# Altium schematic sheet ESP32.SchDoc
size A2; SheetNumber: 1; SheetTotal: 1
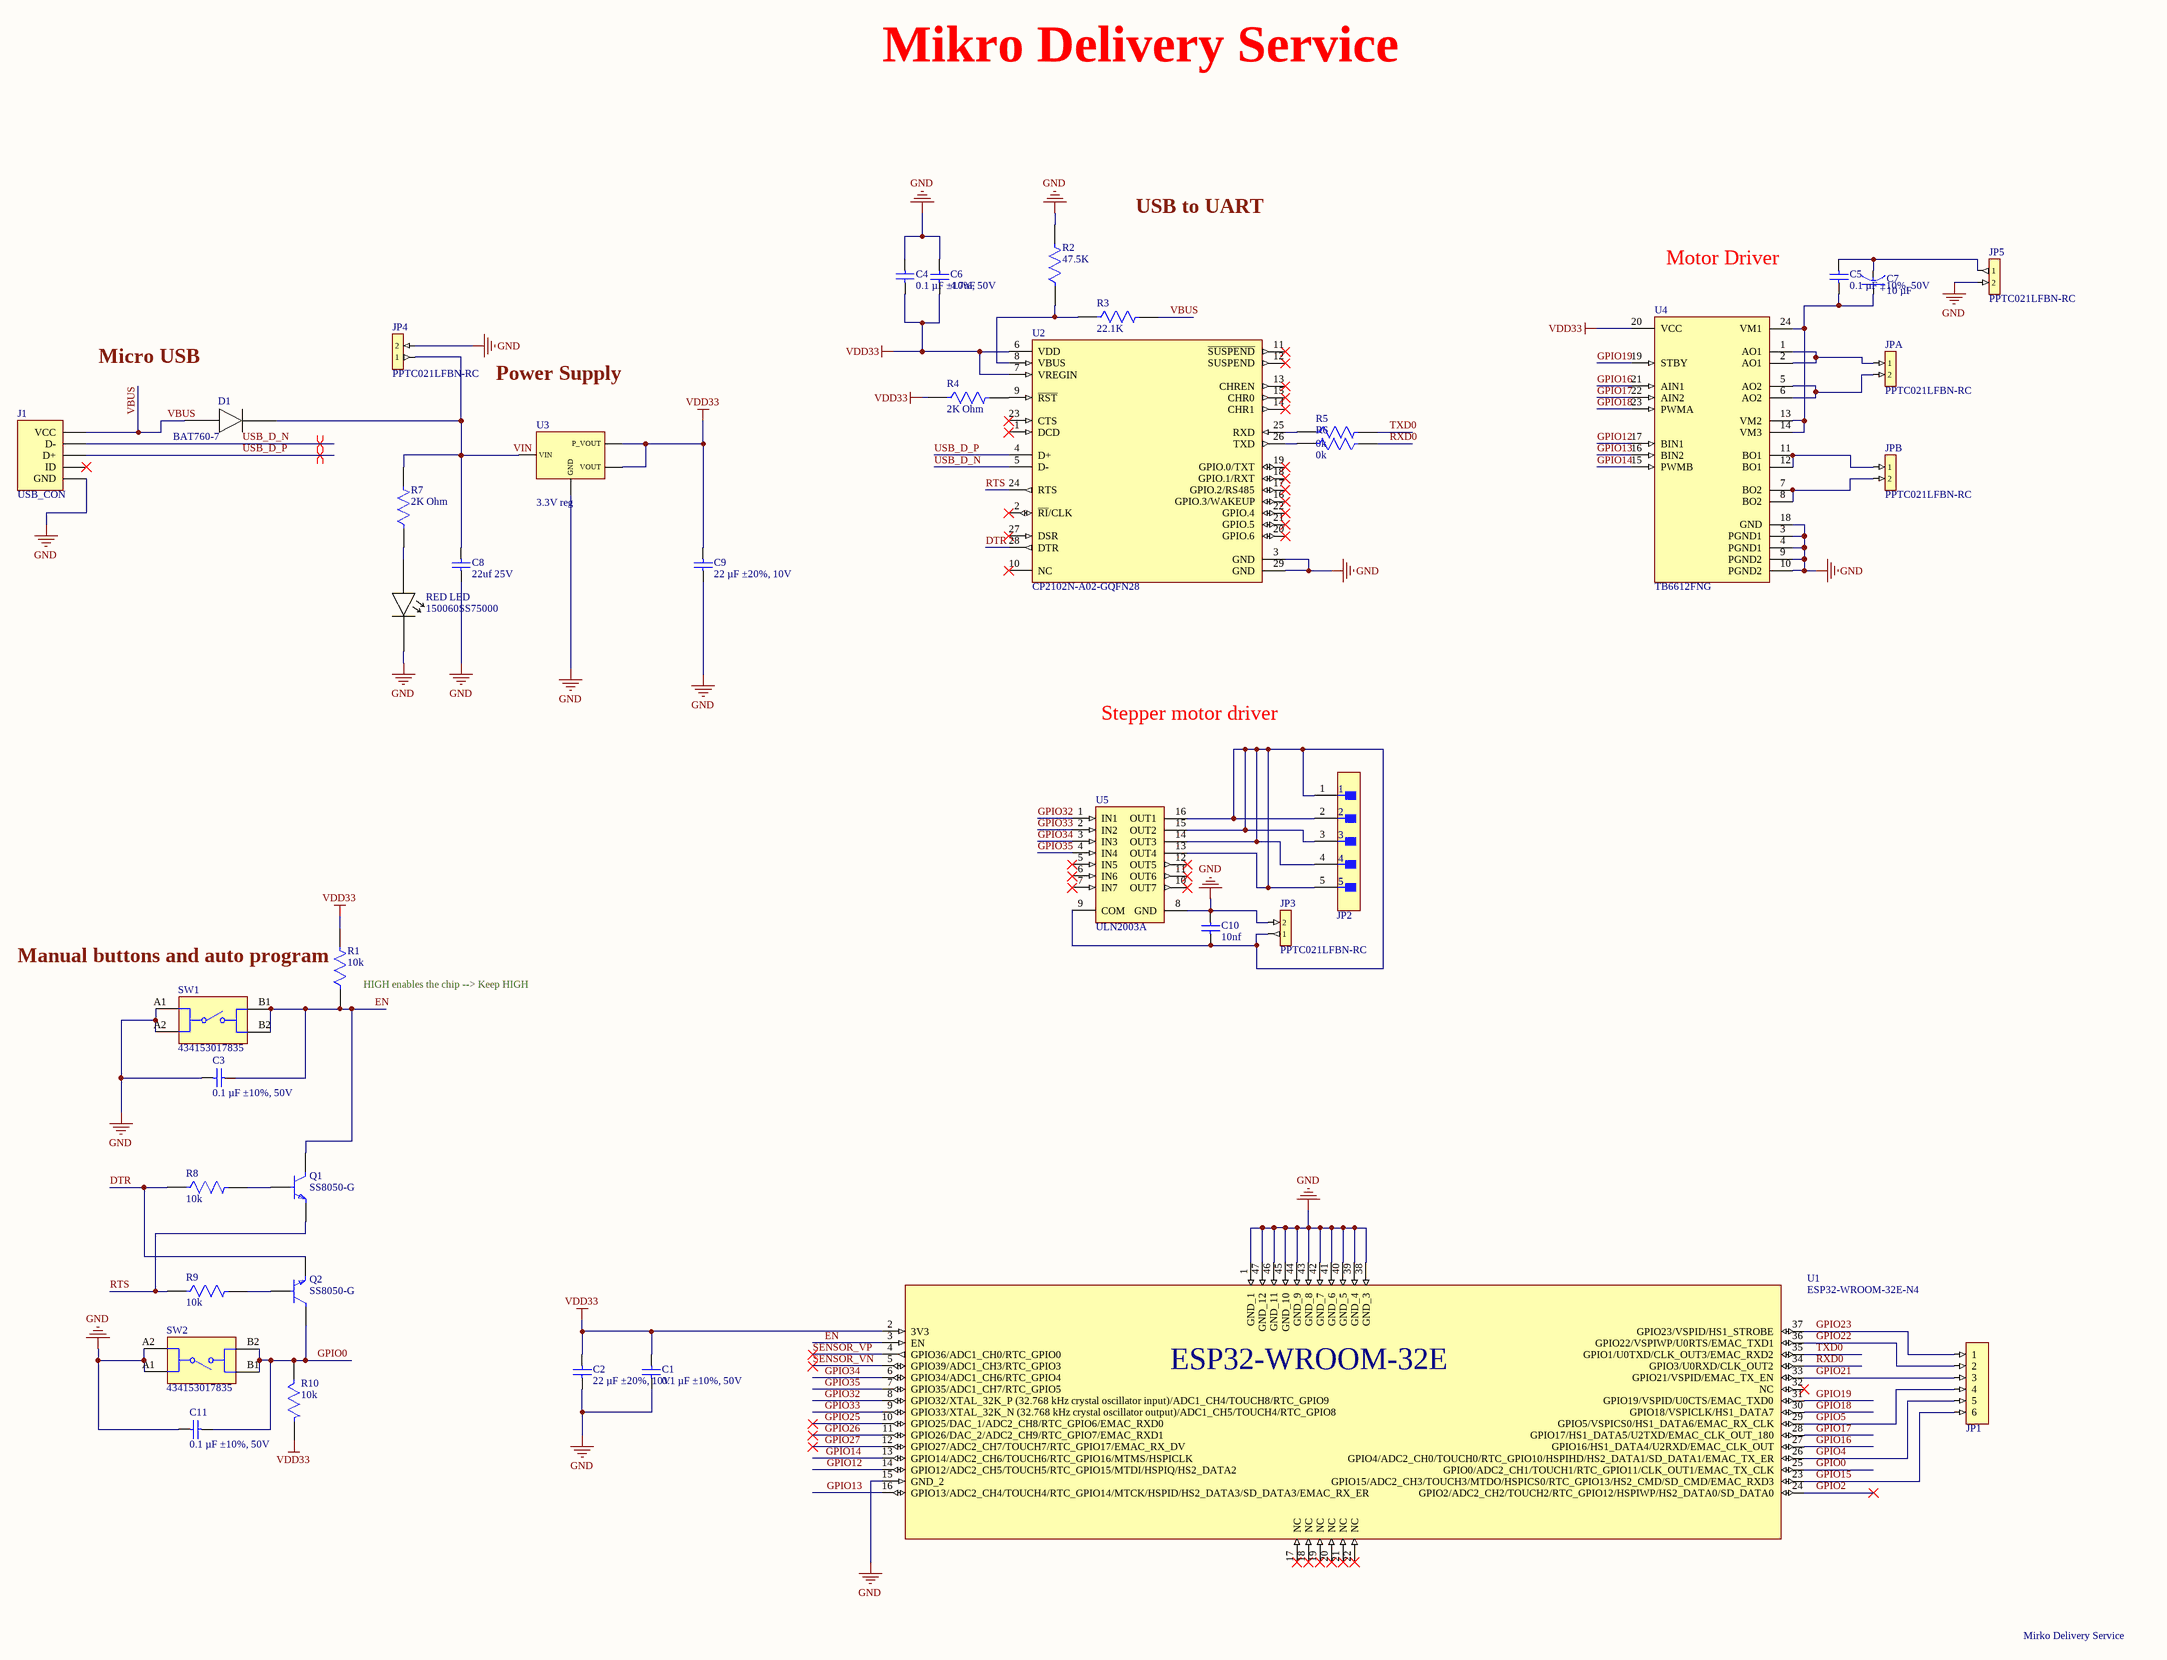
[diagram p0: ESP32.SchDoc]

## Parts
C1  0.1 µF ±10%, 50V  [885012206095]
C2  22 µF ±20%, 10V  [885012108011]
C3  0.1 µF ±10%, 50V  [885012206095]
C4  0.1 µF ±10%, 50V  [885012206095]
C5  0.1 µF ±10%, 50V  [885012206095]
C6  4.7uF  [FP-C0805C475J4RACAUTO-IPC_B]
C7  10 µF  [FP-UWT1C100MCL1GB-MFG]
C8  22uf 25V  [CL31A226KAHNNNE]
C9  22 µF ±20%, 10V  [885012108011]
C10  10nf  [C0402C103K3REC7411]
C11  0.1 µF ±10%, 50V  [885012206095]
D1  BAT760-7  [BAT760-7]
J1  USB_CON  [10118192-0002LF]
JP1  PPPC061LFBN-RC  [PPPC061LFBN-RC]  (value not drawn)
JP2  B5B-XH-A  [FP-B5B-PH-K-S_LF_SN-MFG]  (value not drawn)
JP3  PPTC021LFBN-RC  [PPTC021LFBN-RC]
JP4  PPTC021LFBN-RC  [PPTC021LFBN-RC]
JP5  PPTC021LFBN-RC  [PPTC021LFBN-RC]
JPA  PPTC021LFBN-RC  [PPTC021LFBN-RC]
JPB  PPTC021LFBN-RC  [PPTC021LFBN-RC]
Q1  SS8050-G  [FP-SS8050-G-IPC_B]
Q2  SS8050-G  [FP-SS8050-G-IPC_B]
R1  10k  [FP-RC0402-0_4-IPC_A]
R2  47.5K  [ERJ3EKF4752V]
R3  22.1K  [RC0603FR-0722K1L]
R4  2K Ohm  [560112110015]
R5  0k  [CR0402AJ/-000GAS]
R6  0k  [CR0402AJ/-000GAS]
R7  2K Ohm  [560112110015]
R8  10k  [FP-RC0402-0_4-IPC_A]
R9  10k  [FP-RC0402-0_4-IPC_A]
R10  10k  [FP-RC0402-0_4-IPC_A]
RED_LED  150060SS75000  [150060SS75000]
SW1  434153017835  [434153017835]
SW2  434153017835  [434153017835]
U1  ESP32-WROOM-32E-N4  [FP-ESP32-WROOM-32E_4MB-MFG]
U2  CP2102N-A02-GQFN28  [FP-CP2102N-A02-GQFN28-IPC_C]
U3  3.3V reg  [AMS1117-3.3]
U4  TB6612FNG  [FP-SSOP24-P-300-0_65A-IPC_B]
U5  ULN2003A  [STM-DIP-16L]

## Nets
GND: C1.1 C2.1 C3.1 C4.1 C6.2 C8.1 C9.1 C10.2 C11.1 J1.5(GND) JP3.2 JP4.2 JP5.2 R2.2 RED_LED.1 SW1.A1 SW1.A2 SW2.A1 SW2.A2 U1.1(GND_1) U1.15(GND_2) U1.38(GND_3) U1.39(GND_4) U1.40(GND_5) U1.41(GND_6) U1.42(GND_7) U1.43(GND_8) U1.44(GND_9) U1.45(GND_10) U1.46(GND_11) U1.47(GND_12) U2.3(GND) U2.29(GND) U3.3(GND) U4.3(PGND1) U4.4(PGND1) U4.9(PGND2) U4.10(PGND2) U4.18(GND) U5.8(GND)
VDD33: C1.2 C2.2 C4.2 C6.1 C9.2 R1.2 R4.1 R10.2 U1.2(3V3) U2.6(VDD) U2.7(VREGIN) U3.4(VOUT) U3.5(P_VOUT) U4.20(VCC)
DTR: Q2.2(E) R8.1 U2.28(DTR)
EN: C3.2 Q1.3(C) R1.1 SW1.B1 SW1.B2 U1.3(EN)
GPIO0: C11.2 Q2.3(C) R10.1 SW2.B1 SW2.B2 U1.25(GPIO0/ADC2_CH1/TOUCH1/RTC_GPIO11/CLK_OUT1/EMAC_TX_CLK)
GPIO2: U1.24(GPIO2/ADC2_CH2/TOUCH2/RTC_GPIO12/HSPIWP/HS2_DATA0/SD_DATA0)
GPIO4: JP1.5 U1.26(GPIO4/ADC2_CH0/TOUCH0/RTC_GPIO10/HSPIHD/HS2_DATA1/SD_DATA1/EMAC_TX_ER)
GPIO5: JP1.4 U1.29(GPIO5/VSPICS0/HS1_DATA6/EMAC_RX_CLK)
GPIO12: U1.14(GPIO12/ADC2_CH5/TOUCH5/RTC_GPIO15/MTDI/HSPIQ/HS2_DATA2) U4.17(BIN1)
GPIO13: U1.16(GPIO13/ADC2_CH4/TOUCH4/RTC_GPIO14/MTCK/HSPID/HS2_DATA3/SD_DATA3/EMAC_RX_ER) U4.16(BIN2)
GPIO14: U1.13(GPIO14/ADC2_CH6/TOUCH6/RTC_GPIO16/MTMS/HSPICLK) U4.15(PWMB)
GPIO15: JP1.6 U1.23(GPIO15/ADC2_CH3/TOUCH3/MTDO/HSPICS0/RTC_GPIO13/HS2_CMD/SD_CMD/EMAC_RXD3)
GPIO16: U1.27(GPIO16/HS1_DATA4/U2RXD/EMAC_CLK_OUT) U4.21(AIN1)
GPIO17: U1.28(GPIO17/HS1_DATA5/U2TXD/EMAC_CLK_OUT_180) U4.22(AIN2)
GPIO18: U1.30(GPIO18/VSPICLK/HS1_DATA7) U4.23(PWMA)
GPIO19: U1.31(GPIO19/VSPID/U0CTS/EMAC_TXD0) U4.19(STBY)
GPIO21: JP1.3 U1.33(GPIO21/VSPID/EMAC_TX_EN)
GPIO22: JP1.2 U1.36(GPIO22/VSPIWP/U0RTS/EMAC_TXD1)
GPIO23: JP1.1 U1.37(GPIO23/VSPID/HS1_STROBE)
GPIO25: U1.10(GPIO25/DAC_1/ADC2_CH8/RTC_GPIO6/EMAC_RXD0)
GPIO26: U1.11(GPIO26/DAC_2/ADC2_CH9/RTC_GPIO7/EMAC_RXD1)
GPIO27: U1.12(GPIO27/ADC2_CH7/TOUCH7/RTC_GPIO17/EMAC_RX_DV)
GPIO32: U1.8(GPIO32/XTAL_32K_P_(32.768_kHz_crystal_oscillator_input)/ADC1_CH4/TOUCH8/RTC_GPIO9) U5.1(IN1)
GPIO33: U1.9(GPIO33/XTAL_32K_N_(32.768_kHz_crystal_oscillator_output)/ADC1_CH5/TOUCH4/RTC_GPIO8) U5.2(IN2)
GPIO34: U1.6(GPIO34/ADC1_CH6/RTC_GPIO4) U5.3(IN3)
GPIO35: U1.7(GPIO35/ADC1_CH7/RTC_GPIO5) U5.4(IN4)
RTS: Q1.2(E) R9.1 U2.24(RTS)
RXD0: R6.1 U1.34(GPIO3/U0RXD/CLK_OUT2)
SENSOR_VN: U1.5(GPIO39/ADC1_CH3/RTC_GPIO3)
SENSOR_VP: U1.4(GPIO36/ADC1_CH0/RTC_GPIO0)
TXD0: R5.2 U1.35(GPIO1/U0TXD/CLK_OUT3/EMAC_RXD2)
USB_D_N: J1.2(D-) U2.5(D-)
USB_D_P: J1.3(D+) U2.4(D+)
VBUS: D1.0 J1.1(VCC) R3.2
VIN: C8.2 D1.1 JP4.9(1) R7.2 U3.6(VIN)
NetC5_1: C5.1 C7.2(A) U4.13(VM2) U4.14(VM3) U4.24(VM1)
NetC5_2: C5.2 C7.1(C) JP5.9(1)
NetC10_1: C10.1 JP2.1 JP2.2 JP2.3 JP2.4 JP2.5 JP3.9(1) U5.9(COM) U5.13(OUT4) U5.14(OUT3) U5.15(OUT2) U5.16(OUT1)
NetJPA_2: JPA.2 U4.5(AO2) U4.6(AO2)
NetJPA_9: JPA.9(1) U4.1(AO1) U4.2(AO1)
NetJPB_2: JPB.2 U4.7(BO2) U4.8(BO2)
NetJPB_9: JPB.9(1) U4.11(BO1) U4.12(BO1)
NetQ1_1: Q1.1(B) R8.2
NetQ2_1: Q2.1(B) R9.2
NetR2_1: R2.1 R3.1 U2.8(VBUS)
NetR4_2: R4.2 U2.9(~{RST})
NetR5_1: R5.1 U2.25(RXD)
NetR6_2: R6.2 U2.26(TXD)
NetR7_1: R7.1 RED_LED.0

Not connected (* = marked no-connect by the designer): J1 4(ID)*; U1 17(NC)* 18(NC)* 19(NC)* 20(NC)* 21(NC)* 22(NC)* 32(NC)*; U2 1(DCD)* 2(~{RI}/CLK)* 10(NC)* 11(~{SUSPEND})* 12(SUSPEND)* 13(CHREN)* 14(CHR1)* 15(CHR0)* 16(GPIO.3/WAKEUP)* 17(GPIO.2/RS485)* 18(GPIO.1/RXT)* 19(GPIO.0/TXT)* 20(GPIO.6)* 21(GPIO.5)* 22(GPIO.4)* 23(CTS)* 27(DSR)*; U5 5(IN5)* 6(IN6)* 7(IN7)* 10(OUT7)* 11(OUT6)* 12(OUT5)*

## Layout directives
differential pair; differential pair class DIFF90: USB_D_N, USB_D_P

## Notes on the sheet
- Mikro Delivery Service
- USB to UART
- Motor Driver
- Micro USB
- Power Supply
- Stepper motor driver
- (near R1) Manual buttons and auto program
- (near R1) HIGH enables the chip --> Keep HIGH
- Mirko Delivery Service
- (in symbol ESP32-WROOM-32E-N4) ESP32-WROOM-32E
- (in symbol UWT1C100MCL1GB) +

## Library data of the parts
C1 C3-C5 C11 = 885012206095: 0.1 µF ±10% 50V Ceramic Capacitor X7R 0603 (1608 Metric); Manufacturer: Wurth Electronics; Supplier: Digikey; Supplier Part Number: 732-8013-1-ND; Manufacturer Part Number: 885012206095; RoHS: Yes; Category: Ceramic Capacitors; Stock: 81752; Pricing: 1=0.1, 10=0.051, 100=0.045, 500=0.0396 (USD); Pins: 2; Dielectric Material: Ceramic; Capacitor Type: Ceramic; Reach SVHC Compliant: Yes; RoHS Compliant: Yes; ComponentLink1URL: https://datasheet.ciiva.com:443/pdfs/VipMasterIC/IC/MIDC/MIDC-S-A0001525459/MIDC-S-A0001525484-1.pdf?src-supplier=IHS+Markit; ComponentLink1Description: https://datasheet.ciiva.com:443/pdfs/VipMasterIC/IC/MIDC/MIDC-S-A0001525459/MIDC-S-A0001525484-1.pdf?src-supplier=IHS+Markit; ComponentLink2URL: http://www.farnell.com/datasheets/1958488.pdf?src-supplier=Farnell; ComponentLink2Description: http://www.farnell.com/datasheets/1958488.pdf?src-supplier=Farnell; ComponentLink3URL: http://www.farnell.com/datasheets/1958488.pdf?src-supplier=Element14; ComponentLink3Description: http://www.farnell.com/datasheets/1958488.pdf?src-supplier=Element14; ComponentLink4URL: https://katalog.we-online.de/pbs/datasheet/885012206095.pdf?src-supplier=Digikey; ComponentLink4Description: https://katalog.we-online.de/pbs/datasheet/885012206095.pdf?src-supplier=Digikey; ComponentLink5URL: http://www.farnell.com/datasheets/1958488.pdf?src-supplier=Newark; ComponentLink5Description: http://www.farnell.com/datasheets/1958488.pdf?src-supplier=Newark; ComponentLink6URL: https://datasheet.octopart.com/885012206095-W%C3%BCrth-Elektronik-datasheet-152756925.pdf?src-supplier=Element14; ComponentLink6Description: https://datasheet.octopart.com/885012206095-W%C3%BCrth-Elektronik-datasheet-152756925.pdf?src-supplier=Element14
C2 C9 = 885012108011: 22 µF ±20% 10V Ceramic Capacitor X5R 1206 (3216 Metric); Manufacturer: Wurth Electronics; Supplier: Digikey; Supplier Part Number: 732-7637-1-ND; Manufacturer Part Number: 885012108011; RoHS: Yes; Category: Ceramic Capacitors; Stock: 3497; Pricing: 1=0.68, 10=0.611, 100=0.5481, 500=0.4851 (USD); Pins: 2; Dielectric Material: Ceramic; Capacitor Type: Ceramic; Reach SVHC Compliant: Yes; RoHS Compliant: Yes; ComponentLink1URL: https://datasheet.ciiva.com:443/pdfs/VipMasterIC/IC/MIDC/MIDC-S-A0001526153/MIDC-S-A0001526191-1.pdf?src-supplier=IHS+Markit; ComponentLink1Description: https://datasheet.ciiva.com:443/pdfs/VipMasterIC/IC/MIDC/MIDC-S-A0001526153/MIDC-S-A0001526191-1.pdf?src-supplier=IHS+Markit; ComponentLink2URL: http://www.farnell.com/datasheets/2031775.pdf?src-supplier=Farnell; ComponentLink2Description: http://www.farnell.com/datasheets/2031775.pdf?src-supplier=Farnell; ComponentLink3URL: https://katalog.we-online.de/pbs/datasheet/885012108011.pdf?src-supplier=Digikey; ComponentLink3Description: https://katalog.we-online.de/pbs/datasheet/885012108011.pdf?src-supplier=Digikey
C6 = C0805C475J4RACAUTO: 4.7 µF ±5% 16V Ceramic Capacitor X7R 0805 (2012 Metric); Manufacturer: KEMET; Supplier: Digikey; Supplier Part Number: 399-15716-1-ND; Manufacturer Part Number: C0805C475J4RACAUTO; RoHS: Yes; Category: Ceramic Capacitors; Stock: 14100; Pricing: 1=0.54, 10=0.361, 100=0.2378, 1000=0.18294 (USD); Pins: 2; Dielectric Material: Ceramic; Terminal Finish: Nickel; JESD-609 Code: e3; Capacitor Type: Ceramic; Reach SVHC Compliant: Yes; RoHS Compliant: Yes; ComponentLink1URL: https://datasheet.ciiva.com:443/pdfs/VipMasterIC/IC/KEME/KEME-S-A0009891634/KEME-S-A0009891634-1.pdf?src-supplier=IHS+Markit; ComponentLink1Description: https://datasheet.ciiva.com:443/pdfs/VipMasterIC/IC/KEME/KEME-S-A0009891634/KEME-S-A0009891634-1.pdf?src-supplier=IHS+Markit; ComponentLink2URL: http://www.farnell.com/datasheets/2741387.pdf?src-supplier=Farnell; ComponentLink2Description: http://www.farnell.com/datasheets/2741387.pdf?src-supplier=Farnell; ComponentLink3URL: http://www.farnell.com/datasheets/2741387.pdf?src-supplier=Newark; ComponentLink3Description: http://www.farnell.com/datasheets/2741387.pdf?src-supplier=Newark; ComponentLink4URL: https://api.kemet.com/component-edge/download/datasheet/C0805C475J4RACAUTO.pdf?src-supplier=Digikey; ComponentLink4Description: https://api.kemet.com/component-edge/download/datasheet/C0805C475J4RACAUTO.pdf?src-supplier=Digikey; ComponentLink5URL: https://datasheet.octopart.com/C0805C475J4RACAUTO-KEMET-datasheet-149524417.pdf?src-supplier=Farnell; ComponentLink5Description: https://datasheet.octopart.com/C0805C475J4RACAUTO-KEMET-datasheet-149524417.pdf?src-supplier=Farnell; ComponentLink6URL: https://datasheet.octopart.com/C0805C475J4RACAUTO-KEMET-datasheet-136484028.pdf?src-supplier=TME; ComponentLink6Description: https://datasheet.octopart.com/C0805C475J4RACAUTO-KEMET-datasheet-136484028.pdf?src-supplier=TME
C7 = UWT1C100MCL1GB: 10 µF 16 V Aluminum Electrolytic Capacitors Radial, Can - SMD 1000 Hrs @ 105°C; Manufacturer: Nichicon; Dielectric Material: Aluminium; Polarity: Polarized; Value: 10uF; Leakage Current: 3uA; Tolerance  (fill in as +-): 20%; Rated DC Voltage (URdc): 16V; Ripple Current: 14mA; Tan Delta: 0.2; Supplier: Digikey; Supplier Part Number: 493-2173-1-ND; Manufacturer Part Number: UWT1C100MCL1GB; RoHS: Yes; Category: Aluminum Electrolytic Capacitors; Stock: 73707; Pricing: 1=0.29, 10=0.189, 50=0.1452, 100=0.1309, 500=0.1049, 1000=0.09623 (USD); Mounting Technology: Surface Mount; Pins: 2; Package Shape: Cylindrical; Case/Package: 1717; Terminal Finish: Tin; Min Operating Temperature: -55°C; Max Operating Temperature: 105°C; JESD-609 Code: e6; Capacitor Type: Aluminium; Package Style: SMTMeter; Packaging: Tape and Reel; Tolerance (fill in as +-): 20%; Termination: One Surface; Length: 4.6mm; Width: 4.3mm; Height: 5.4mm; Reach SVHC Compliant: No; RoHS Compliant: Yes; ComponentLink1URL: https://datasheet.ciiva.com:443/pdfs/VipMasterIC/IC/NICH/NICH-S-A0009252174/NICH-S-A0009252174-1.pdf?src-supplier=IHS+Markit; ComponentLink1Description: https://datasheet.ciiva.com:443/pdfs/VipMasterIC/IC/NICH/NICH-S-A0009252174/NICH-S-A0009252174-1.pdf?src-supplier=IHS+Markit; ComponentLink2URL: https://datasheet.ciiva.com/96/e-wt-96198.pdf?src-supplier=Digikey; ComponentLink2Description: https://datasheet.ciiva.com/96/e-wt-96198.pdf?src-supplier=Digikey; ComponentLink3URL: https://datasheet.ciiva.com/96/e-wt-96199.pdf?src-supplier=Digikey; ComponentLink3Description: https://datasheet.ciiva.com/96/e-wt-96199.pdf?src-supplier=Digikey; ComponentLink4URL: https://datasheet.ciiva.com/96/e-wt-96200.pdf?src-supplier=Digikey; ComponentLink4Description: https://datasheet.ciiva.com/96/e-wt-96200.pdf?src-supplier=Digikey; ComponentLink5URL: https://datasheet.ciiva.com/16392/e-wt-16392925.pdf?src-supplier=Future+Electronics; ComponentLink5Description: https://datasheet.ciiva.com/16392/e-wt-16392925.pdf?src-supplier=Future+Electronics
C8 = CL31A226KAHNNNE: 22 µF ±10% 25V Ceramic Capacitor X5R 1206 (3216 Metric); Manufacturer: Samsung; Multilayer: Yes; Supplier: Digikey; Supplier Part Number: 1276-3047-1-ND; Manufacturer Part Number: CL31A226KAHNNNE; RoHS: Yes; Category: Ceramic Capacitors; Stock: 848165; Pricing: 1=0.22, 10=0.134, 100=0.1016, 1000=0.0768 (USD); Mounting Technology: Surface Mount; Pins: 2; Dielectric Material: Ceramic; Package Shape: Rectangular; Case/Package: 1206; Terminal Finish: Nickel; Min Operating Temperature: -55°C; Max Operating Temperature: 85°C; JESD-609 Code: e3; Value: 22uF; Capacitor Type: Ceramic; Tolerance  (fill in as +-): 10%; Package Style: SMTMeter; Packaging: Tape and Reel; Tolerance (fill in as +-): 10%; Rated DC Voltage (URdc): 25V; Temperature Characteristics Code: X5R; Termination: Wraparound; Length: 3.2mm; Width: 1.6mm; Height: 1.8mm; Reach SVHC Compliant: Yes; RoHS Compliant: Yes; ComponentLink1URL: https://datasheet.ciiva.com:443/pdfs/VipMasterIC/IC/SEMS/SEMS-S-A0008384515/SEMS-S-A0008873224-1.pdf?src-supplier=IHS+Markit; ComponentLink1Description: https://datasheet.ciiva.com:443/pdfs/VipMasterIC/IC/SEMS/SEMS-S-A0008384515/SEMS-S-A0008873224-1.pdf?src-supplier=IHS+Markit; ComponentLink2URL: https://datasheet.ciiva.com/29201/452249-da-01-en-vs-kondensator-1206-29201336.pdf?src-supplier=Conrad; ComponentLink2Description: https://datasheet.ciiva.com/29201/452249-da-01-en-vs-kondensator-1206-29201336.pdf?src-supplier=Conrad
C10 = C0402C103K3REC7411: 10 nF ±10% 25V Ceramic Capacitor X7R 0402 (1005 Metric); Manufacturer: KEMET; Supplier: Digikey; Supplier Part Number: 399-C0402C103K3REC7411CT-ND; Manufacturer Part Number: C0402C103K3REC7411; RoHS: Yes; Category: Ceramic Capacitors; Stock: 35408; Pricing: 1=0.1, 10=0.052, 100=0.0335, 1000=0.02108, 2500=0.01861, 5000=0.01838 (USD); Pins: 2; Dielectric Material: Ceramic; Capacitor Type: Ceramic; Reach SVHC Compliant: Yes; RoHS Compliant: Yes; ComponentLink1URL: https://datasheet.ciiva.com:443/pdfs/VipMasterIC/IC/KEME/KEME-S-A0008958450/KEME-S-A0008958450-1.pdf?src-supplier=IHS+Markit; ComponentLink1Description: https://datasheet.ciiva.com:443/pdfs/VipMasterIC/IC/KEME/KEME-S-A0008958450/KEME-S-A0008958450-1.pdf?src-supplier=IHS+Markit; ComponentLink2URL: https://api.kemet.com/component-edge/download/datasheet/C0402C103K3REC7411.pdf?src-supplier=Digikey; ComponentLink2Description: https://api.kemet.com/component-edge/download/datasheet/C0402C103K3REC7411.pdf?src-supplier=Digikey
D1 = BAT760-7: Rectifier Diode, Schottky, 1 Phase, 1 Element, 1A, 30V V(RRM), Silicon; Manufacturer: Diodes; Package Body Material: Plastic; Additional Feature: HIGH RELIABILITY; Forward Voltage: 270mV; Non-rep Pk Forward Current-Max: 5.5A; Number of Elements: 1; Max Power Dissipation: 235mW; Time @ Peak Reflow Temperature-Max (s): 40s; Qualification Status: Not Qualified; Supplier: Digikey; Supplier Part Number: BAT760DICT-ND; Manufacturer Part Number: BAT760-7; RoHS: Yes; Category: Rectifier Diodes; Stock: 17947; Pricing: 1=0.55, 10=0.273, 100=0.2336, 500=0.17744, 1000=0.16605 (USD); Pins: 2; Diode Element Material: SILICON; Package Shape: Rectangular; Terminal Finish: Tin; Min Operating Temperature: -65°C; Max Operating Temperature: 125°C; JESD-609 Code: e3; Diode Type: RECTIFIER; JESD-30 Code: R-PDSO-G2; Moisture Sensitivity Level: 1; Max Output current: 1A; Package Style: SMALL OUTLINEMeter; Peak Reflow Temperature (Cel): 260°C; Rep Pk Reverse Voltage-Max: 30V; Surface Mount: Yes; Technology: SCHOTTKY; Terminal Form: Gull Wing; Terminal Position: DUAL; Reach SVHC Compliant: Yes; RoHS Compliant: Yes; ComponentLink1URL: https://datasheet.ciiva.com:443/pdfs/VipMasterIC/IC/DIOD/DIOD-S-A0004140720/DIOD-S-A0004140720-1.pdf?src-supplier=IHS+Markit; ComponentLink1Description: https://datasheet.ciiva.com:443/pdfs/VipMasterIC/IC/DIOD/DIOD-S-A0004140720/DIOD-S-A0004140720-1.pdf?src-supplier=IHS+Markit; ComponentLink2URL: https://datasheet.ciiva.com/8301/ds30498-8301400.pdf?src-supplier=Avnet; ComponentLink2Description: https://datasheet.ciiva.com/8301/ds30498-8301400.pdf?src-supplier=Avnet; ComponentLink3URL: https://datasheet.ciiva.com/4715/ds30498-63155-4715521.pdf?src-supplier=Mouser; ComponentLink3Description: https://datasheet.ciiva.com/4715/ds30498-63155-4715521.pdf?src-supplier=Mouser; ComponentLink4URL: https://datasheet.ciiva.com/1178/ds30498-1178033.pdf?src-supplier=Element14; ComponentLink4Description: https://datasheet.ciiva.com/1178/ds30498-1178033.pdf?src-supplier=Element14; ComponentLink5URL: https://datasheet.ciiva.com/914/ds30498-914551.pdf?src-supplier=Digikey; ComponentLink5Description: https://datasheet.ciiva.com/914/ds30498-914551.pdf?src-supplier=Digikey; ComponentLink6URL: https://datasheet.ciiva.com/914/ds30498-914552.pdf?src-supplier=Digikey; ComponentLink6Description: https://datasheet.ciiva.com/914/ds30498-914552.pdf?src-supplier=Digikey; ComponentLink7URL: https://datasheet.ciiva.com/914/ds30498-914553.pdf?src-supplier=Digikey; ComponentLink7Description: https://datasheet.ciiva.com/914/ds30498-914553.pdf?src-supplier=Digikey; ComponentLink8URL: https://datasheet.ciiva.com/22695/1670989-22695799.pdf?src-supplier=Element14; ComponentLink8Description: https://datasheet.ciiva.com/22695/1670989-22695799.pdf?src-supplier=Element14
J1 = 10118192-0002LF: Conn Micro USB 2.0 Type B RCP 5 POS 0.65mm Solder RA SMD 5 Terminal 1 Port T/R; Manufacturer: Amphenol ICC / FCI; Supplier: Rs; Supplier Part Number: 2208500; Manufacturer Part Number: 10118192-0002LF; RoHS: No; Category: USB Connectors; Stock: 100; ComponentLink1URL: http://www.amphenol-icc.com/media/wysiwyg/files/drawing/10118192.pdf?src-supplier=Digikey; ComponentLink1Description: http://www.amphenol-icc.com/media/wysiwyg/files/drawing/10118192.pdf?src-supplier=Digikey
JP1 = PPPC061LFBN-RC: Board Connector, 6 Contact(s), 1 Row(s), Female, Straight, 0.1 inch Pitch, Solder Terminal, Locking, Socket; Manufacturer: Sullins; Manufacturer Series: PP; Contact Pattern: RECTANGULAR; Contact Style: SQ PIN-SKT; Number Of Connectors: 1; Polarization Key: POLARIZED HOUSING; Rated Current (Signal): 3A; Number of Contacts: 6; Body Breadth: 0.094inch; Body Depth: 0.334inch; Body Length: 0.62inch; Reference Standard: UL; Reliability: COMMERCIAL; Supplier: Digikey; Supplier Part Number: S7039-ND; Manufacturer Part Number: PPPC061LFBN-RC; RoHS: Yes; Category: Headers and Wire Housings; Stock: 15403; Pricing: 1=0.47, 10=0.398, 80=0.34363, 440=0.30461, 1000=0.28745, 5000=0.25659, 10000=0.24434 (USD); Mounting Technology: Board; Contact Material: Bronze; Contact Finish - Mating: AU; Insulation Material: Polyester; Connector Type: BOARD CONNECTOR; Contact Gender: Female; Mounting Style: STRAIGHT; Number Of PCB Rows: 1; Number of Rows Loaded: 1; PCB Contact Pattern: RECTANGULAR; Termination: Solder; Mating Contact Pitch: 0.1inch; Mounting Option 1: LOCKING; Terminal Length: 0.125inch; Terminal Pitch: 2.54mm; Reach SVHC Compliant: Yes; RoHS Compliant: Yes; ComponentLink1URL: https://datasheet.ciiva.com:443/pdfs/VipMasterIC/IC/SUCS/SUCSS00270/SUCSS00270-1.pdf?src-supplier=IHS+Markit; ComponentLink1Description: https://datasheet.ciiva.com:443/pdfs/VipMasterIC/IC/SUCS/SUCSS00270/SUCSS00270-1.pdf?src-supplier=IHS+Markit; ComponentLink2URL: https://media.digikey.com/pdf/Data%20Sheets/Sullins%20PDFs/Female_Headers.100_DS.pdf?src-supplier=Digikey; ComponentLink2Description: https://media.digikey.com/pdf/Data%20Sheets/Sullins%20PDFs/Female_Headers.100_DS.pdf?src-supplier=Digikey
JP2 = B5B-XH-A: Connector Header Through Hole 5 position 0.098" (2.50mm); Manufacturer: JST; Supplier: Digikey; Supplier Part Number: 455-B5B-XH-A-ND; Manufacturer Part Number: B5B-XH-A; RoHS: Yes; Category: Headers and Wire Housings; Stock: 211742; Pricing: 1=0.21, 10=0.178, 100=0.1513, 500=0.13504, 1000=0.12858, 5000=0.11476, 10000=0.10929 (USD); ComponentLink1URL: https://www.distrelec.biz/Web/Downloads/_t/ds/xh-series_eng_tds.pdf?mime=application%2Fpdf&src-supplier=Distrelec; ComponentLink1Description: https://www.distrelec.biz/Web/Downloads/_t/ds/xh-series_eng_tds.pdf?mime=application%2Fpdf&src-supplier=Distrelec
JP3-JP5 JPA JPB = PPTC021LFBN-RC: 2 Position Header Connector 0.100" (2.54mm) Through Hole Tin; Manufacturer: Sullins; Manufacturer Series: PP; Connector Type: BOARD CONNECTOR; Number of Contacts: 2; Contact Pattern: RECTANGULAR; Contact Style: SQ PIN-SKT; Number Of Connectors: 1; Polarization Key: POLARIZED HOUSING; Rated Current (Signal): 3A; Body Breadth: 0.094inch; Body Depth: 0.334inch; Body Length: 0.22inch; Mating Contact Pitch: 0.1inch; Mounting Option 1: LOCKING; Reference Standard: UL; Reliability: COMMERCIAL; Supplier: Digikey; Supplier Part Number: S7000-ND; Manufacturer Part Number: PPTC021LFBN-RC; RoHS: Yes; Category: Connectors; Stock: 25108; Pricing: 1=0.26, 10=0.221, 100=0.1875, 500=0.1673, 1000=0.1593, 5000=0.14219, 10000=0.1354 (USD); Mounting Technology: Board; Contact Material: Bronze; Contact Finish - Mating: SN; Contact Finish - Termination: Tin (Sn) - with Nickel (Ni) barrier; Insulation Material: Polyester; Contact Gender: Female; Termination: Solder; JESD-609 Code: e3; Mounting Style: STRAIGHT; Number Of PCB Rows: 1; Number of Rows Loaded: 1; PCB Contact Pattern: RECTANGULAR; Terminal Length: 0.125inch; Terminal Pitch: 2.54mm; Reach SVHC Compliant: Yes; RoHS Compliant: Yes; ComponentLink1URL: https://datasheet.ciiva.com:443/pdfs/VipMasterIC/IC/SUCS/SUCSS00270/SUCSS00270-1.pdf?src-supplier=IHS+Markit; ComponentLink1Description: https://datasheet.ciiva.com:443/pdfs/VipMasterIC/IC/SUCS/SUCSS00270/SUCSS00270-1.pdf?src-supplier=IHS+Markit; ComponentLink2URL: https://media.digikey.com/pdf/Data%20Sheets/Sullins%20PDFs/Female_Headers.100_DS.pdf?src-supplier=Digikey; ComponentLink2Description: https://media.digikey.com/pdf/Data%20Sheets/Sullins%20PDFs/Female_Headers.100_DS.pdf?src-supplier=Digikey; ComponentLink3URL: http://www.sullinscorp.com/catalogs/78_Page80-81_HEADER_.100_2.54mm_FEMALE.pdf?src-supplier=Future+Electronics; ComponentLink3Description: http://www.sullinscorp.com/catalogs/78_Page80-81_HEADER_.100_2.54mm_FEMALE.pdf?src-supplier=Future+Electronics; ComponentLink4URL: https://datasheet.octopart.com/PPTC021LFBN-RC-Sullins-datasheet-41308905.pdf?src-supplier=Future+Electronics; ComponentLink4Description: https://datasheet.octopart.com/PPTC021LFBN-RC-Sullins-datasheet-41308905.pdf?src-supplier=Future+Electronics
Q1 Q2 = SS8050-G: Bipolar (BJT) Transistor NPN 25 V 1.5 A 100MHz 300 mW Surface Mount SOT-23-3; Manufacturer: Comchip; Supplier: Digikey; Supplier Part Number: 641-1790-1-ND; Manufacturer Part Number: SS8050-G; RoHS: Yes; Category: Transistors; Stock: 149685; Pricing: 1=0.24, 10=0.148, 100=0.0921, 500=0.06754, 1000=0.05958 (USD); Reach SVHC Compliant: Yes; RoHS Compliant: Yes; ComponentLink1URL: https://datasheet.ciiva.com:443/pdfs/VipMasterIC/IC/COMC/COMC-S-A0004994192/COMC-S-A0004994192-1.pdf?src-supplier=IHS+Markit; ComponentLink1Description: https://datasheet.ciiva.com:443/pdfs/VipMasterIC/IC/COMC/COMC-S-A0004994192/COMC-S-A0004994192-1.pdf?src-supplier=IHS+Markit; ComponentLink2URL: http://www.comchiptech.com/admin/files/product/SS8050-G RevA181526.pdf?src-supplier=Digikey; ComponentLink2Description: http://www.comchiptech.com/admin/files/product/SS8050-G RevA181526.pdf?src-supplier=Digikey
R1 R8-R10 = RC0402JR-0710KL: 10 kOhms ±5% 0.063W, 1/16W Chip Resistor 0402 (1005 Metric) Moisture Resistant Thick Film; Manufacturer: Yageo; Additional Feature: LASER TRIMMABLE; Power: 62.5mW; Rated Temperature: 70°C; Value: 10kR; Working Voltage: 50V; Temperature Coefficient (ppm/Cel): 100; Package Height: 0.35mm; Package Length: 1mm; Package Width: 0.5mm; Supplier: Digikey; Supplier Part Number: 311-10KJRCT-ND; Manufacturer Part Number: RC0402JR-0710KL; RoHS: Yes; Category: Chip SMD Resistors; Stock: 17927190; Pricing: 1=0.1, 10=0.007, 50=0.0066, 100=0.0061, 500=0.0051, 1000=0.00408 (USD); Mounting Technology: Surface Mount; Pins: 2; Package Shape: Rectangular; Case/Package: 0402; Terminal Finish: Nickel; Min Operating Temperature: -55°C; Max Operating Temperature: 155°C; Tolerance: 5%; JESD-609 Code: e3; Resistor Type: FIXED RESISTOR; Construction: Chip; Packaging: Tape and Reel; Technology: METAL GLAZE/THICK FILM; Termination: Wraparound; Reach SVHC Compliant: Yes; RoHS Compliant: Yes; ComponentLink1URL: https://datasheet.ciiva.com:443/pdfs/VipMasterIC/IC/YAGO/YAGO-S-A0008145938/YAGO-S-A0008145938-1.pdf?src-supplier=IHS+Markit; ComponentLink1Description: https://datasheet.ciiva.com:443/pdfs/VipMasterIC/IC/YAGO/YAGO-S-A0008145938/YAGO-S-A0008145938-1.pdf?src-supplier=IHS+Markit; ComponentLink2URL: https://datasheet.ciiva.com/2452/pyu-r-int-thick-7-2452627.pdf?src-supplier=Digikey; ComponentLink2Description: https://datasheet.ciiva.com/2452/pyu-r-int-thick-7-2452627.pdf?src-supplier=Digikey; ComponentLink3URL: https://datasheet.ciiva.com/2452/pyu-r-int-thick-7-2452628.pdf?src-supplier=Digikey; ComponentLink3Description: https://datasheet.ciiva.com/2452/pyu-r-int-thick-7-2452628.pdf?src-supplier=Digikey; ComponentLink4URL: https://datasheet.ciiva.com/2452/pyu-r-int-thick-7-2452626.pdf?src-supplier=Digikey; ComponentLink4Description: https://datasheet.ciiva.com/2452/pyu-r-int-thick-7-2452626.pdf?src-supplier=Digikey; ComponentLink5URL: https://datasheet.ciiva.com/12669/pyu-rc0402-51-rohs-l-6-r-12669687.pdf?src-supplier=Mouser; ComponentLink5Description: https://datasheet.ciiva.com/12669/pyu-rc0402-51-rohs-l-6-r-12669687.pdf?src-supplier=Mouser; ComponentLink6URL: https://datasheet.ciiva.com/7850/1018594-7850137.pdf?src-supplier=Element14; ComponentLink6Description: https://datasheet.ciiva.com/7850/1018594-7850137.pdf?src-supplier=Element14; ComponentLink7URL: https://datasheet.ciiva.com/7850/1018594-7850136.pdf?src-supplier=Element14; ComponentLink7Description: https://datasheet.ciiva.com/7850/1018594-7850136.pdf?src-supplier=Element14
R2 = ERJ-3EKF4752V: 47.5 kOhms ±1% 0.1W, 1/10W Chip Resistor 0603 (1608 Metric) Automotive AEC-Q200 Thick Film; Manufacturer: Panasonic; Power: 100mW; Rated Temperature: 70°C; Value: 47.5kR; Working Voltage: 75V; Temperature Coefficient (ppm/Cel): 100; Package Height: 0.45mm; Package Length: 1.6mm; Package Width: 0.8mm; Supplier: Digikey; Supplier Part Number: P47.5KHCT-ND; Manufacturer Part Number: ERJ-3EKF4752V; RoHS: Yes; Category: Chip SMD Resistors; Stock: 242020; Pricing: 1=0.1, 10=0.035, 100=0.0177, 1000=0.01014, 2500=0.00847 (USD); Mounting Technology: Surface Mount; Pins: 2; Package Shape: Rectangular; Case/Package: 0603; Terminal Finish: Nickel; Min Operating Temperature: -55°C; Max Operating Temperature: 155°C; Tolerance: 1%; JESD-609 Code: e3; Resistor Type: FIXED RESISTOR; Construction: Rectangular; Packaging: Tape and Reel; Technology: METAL GLAZE/THICK FILM; Termination: Wraparound; Reference Standard: AEC-Q200; Reach SVHC Compliant: Yes; RoHS Compliant: Yes; ComponentLink1URL: https://datasheet.ciiva.com:443/pdfs/VipMasterIC/IC/PANA/PANA-S-A0009889626/PANA-S-A0009889626-1.pdf?src-supplier=IHS+Markit; ComponentLink1Description: https://datasheet.ciiva.com:443/pdfs/VipMasterIC/IC/PANA/PANA-S-A0009889626/PANA-S-A0009889626-1.pdf?src-supplier=IHS+Markit
R3 = RC0603FR-0722K1L: 22.1 kOhms ±1% 0.1W, 1/10W Chip Resistor 0603 (1608 Metric) Moisture Resistant Thick Film; Manufacturer: Yageo; Additional Feature: LASER TRIMMABLE; Power: 100mW; Rated Temperature: 70°C; Value: 22.1kR; Working Voltage: 75V; Temperature Coefficient (ppm/Cel): 100; Package Height: 0.45mm; Package Length: 1.6mm; Package Width: 0.8mm; Supplier: Digikey; Supplier Part Number: 311-22.1KHRCT-ND; Manufacturer Part Number: RC0603FR-0722K1L; RoHS: Yes; Category: Chip SMD Resistors; Stock: 45696; Pricing: 1=0.1, 10=0.009, 100=0.0071, 1000=0.00612, 2500=0.00461 (USD); Mounting Technology: Surface Mount; Pins: 2; Package Shape: Rectangular; Case/Package: 0603; Terminal Finish: Nickel; Min Operating Temperature: -55°C; Max Operating Temperature: 155°C; Tolerance: 1%; JESD-609 Code: e3; Resistor Type: FIXED RESISTOR; Construction: Chip; Packaging: Tape and Reel; Technology: METAL GLAZE/THICK FILM; Termination: Wraparound; Reach SVHC Compliant: Yes; RoHS Compliant: Yes; ComponentLink1URL: https://datasheet.ciiva.com:443/pdfs/VipMasterIC/IC/YAGO/YAGO-S-A0008145938/YAGO-S-A0008145938-1.pdf?src-supplier=IHS+Markit; ComponentLink1Description: https://datasheet.ciiva.com:443/pdfs/VipMasterIC/IC/YAGO/YAGO-S-A0008145938/YAGO-S-A0008145938-1.pdf?src-supplier=IHS+Markit; ComponentLink2URL: https://datasheet.ciiva.com/12555/rc0603-272842-12555287.pdf?src-supplier=Mouser; ComponentLink2Description: https://datasheet.ciiva.com/12555/rc0603-272842-12555287.pdf?src-supplier=Mouser
R4 R7 = 560112110015: 2 kOhms ±5% 0.1W, 1/10W Chip Resistor 0402 (1005 Metric) Anti-Sulfur Thick Film; Manufacturer: Wurth Electronics; Supplier: Digikey; Supplier Part Number: 732-560112110015CT-ND; Manufacturer Part Number: 560112110015; RoHS: No; Category: Chip SMD Resistors; Stock: 20000; Pricing: 1=0.1, 50=0.0496, 500=0.0333, 5000=0.0252 (USD)
R5 R6 = CR0402AJ/-000GAS: 0 Ohms Jumper Chip Resistor 0402 (1005 Metric) Anti-Sulfur, Automotive AEC-Q200, Moisture Resistant Thick Film; Manufacturer: Bourns; Supplier: Digikey; Supplier Part Number: CR0402AJ/-000GASCT-ND; Manufacturer Part Number: CR0402AJ/-000GAS; RoHS: Yes; Category: Chip SMD Resistors; Stock: 139709; Pricing: 1=0.1, 10=0.024, 50=0.0144, 100=0.0117, 500=0.00752, 1000=0.00635, 5000=0.00442 (USD); ComponentLink1URL: https://datasheet.ciiva.com:443/pdfs/VipMasterIC/IC/BOUR/BOUR-S-A0008933277/BOUR-S-A0008933277-1.pdf?src-supplier=IHS+Markit; ComponentLink1Description: https://datasheet.ciiva.com:443/pdfs/VipMasterIC/IC/BOUR/BOUR-S-A0008933277/BOUR-S-A0008933277-1.pdf?src-supplier=IHS+Markit; ComponentLink2URL: https://www.bourns.com/docs/product-datasheets/crxxxxa-as.pdf?src-supplier=Digikey; ComponentLink2Description: https://www.bourns.com/docs/product-datasheets/crxxxxa-as.pdf?src-supplier=Digikey; ComponentLink3URL: https://datasheet.octopart.com/CR0402AJ--000GAS-Bourns-datasheet-166097895.pdf?src-supplier=Electro+Sonic; ComponentLink3Description: https://datasheet.octopart.com/CR0402AJ--000GAS-Bourns-datasheet-166097895.pdf?src-supplier=Electro+Sonic
RED_LED = 150060SS75000: Red 630nm LED Indication - Discrete 1.9V 0603 (1608 Metric); Manufacturer: Wurth Electronics; Shape: Rectangular; Lens Style: WATER CLEAR; Forward Current: 30mA; Luminous Intensity-Nom: 60mcd; Channels: 1; Optoelectronic Device Type: SINGLE COLOR LED; Viewing Angle: 140°; Overall Height: 0.7mm; Supplier: Digikey; Supplier Part Number: 732-4979-1-ND; Manufacturer Part Number: 150060SS75000; RoHS: Yes; Category: LEDs; Stock: 41067; Pricing: 1=0.14, 50=0.1278, 100=0.1098, 500=0.10124 (USD); Mounting Technology: Surface Mount; Pins: 2; Color: Red; Min Operating Temperature: -40°C; Max Operating Temperature: 85°C; Packaging: Tape and Reel; Size: 1.1mm; Terminal Pitch: 1.6mm; Reach SVHC Compliant: Yes; RoHS Compliant: Yes; ComponentLink1URL: https://datasheet.ciiva.com:443/pdfs/VipMasterIC/IC/MIDC/MIDC-S-A0007768811/MIDC-S-A0007768811-1.pdf?src-supplier=IHS+Markit; ComponentLink1Description: https://datasheet.ciiva.com:443/pdfs/VipMasterIC/IC/MIDC/MIDC-S-A0007768811/MIDC-S-A0007768811-1.pdf?src-supplier=IHS+Markit; ComponentLink2URL: https://datasheet.ciiva.com/23843/150060ss75000-23843248.pdf?src-supplier=Newark; ComponentLink2Description: https://datasheet.ciiva.com/23843/150060ss75000-23843248.pdf?src-supplier=Newark; ComponentLink3URL: https://datasheet.ciiva.com/29279/759429-da-01-en-chipled-0603-w-kl-s-rot-150060ss75000-29279208.pdf?src-supplier=Conrad; ComponentLink3Description: https://datasheet.ciiva.com/29279/759429-da-01-en-chipled-0603-w-kl-s-rot-150060ss75000-29279208.pdf?src-supplier=Conrad; ComponentLink4URL: https://datasheet.ciiva.com/48430/150060ss75000-eng-tds-48430042.pdf?src-supplier=Distrelec; ComponentLink4Description: https://datasheet.ciiva.com/48430/150060ss75000-eng-tds-48430042.pdf?src-supplier=Distrelec
SW1 SW2 = 434153017835: Keypad Switch, 1 Switches, SPST, Momentary, 0.05A, 12VDC, 3.92N, Solder Terminal, Surface Mount-straight; Manufacturer: Wurth Electronics; Supplier: Digikey; Supplier Part Number: 732-10143-1-ND; Manufacturer Part Number: 434153017835; RoHS: Yes; Category: Tactile Switches; Stock: 10405; Pricing: 1=0.54, 100=0.4527, 500=0.3969, 1000=0.3195 (USD); RoHS Compliant: Yes; ComponentLink1URL: https://datasheet.ciiva.com:443/pdfs/VipMasterIC/IC/MIDC/MIDC-S-A0007332294/MIDC-S-A0007339011-1.pdf?src-supplier=IHS+Markit; ComponentLink1Description: https://datasheet.ciiva.com:443/pdfs/VipMasterIC/IC/MIDC/MIDC-S-A0007332294/MIDC-S-A0007339011-1.pdf?src-supplier=IHS+Markit; ComponentLink2URL: https://datasheet.ciiva.com/52202/434153017835-52202871.pdf?src-supplier=Digikey; ComponentLink2Description: https://datasheet.ciiva.com/52202/434153017835-52202871.pdf?src-supplier=Digikey
U1 = ESP32-WROOM-32E-N4: WiFi-Module 802.11/BT 2, 4-2, 5GHz 150Mb/s; Manufacturer: Espressif Systems; Supplier: Digikey; Supplier Part Number: 1965-ESP32-WROOM-32E-N4CT-ND; Manufacturer Part Number: ESP32-WROOM-32E-N4; RoHS: No; Category: LDO; Stock: 8795; Pricing: 1=2.5 (USD); ComponentLink1URL: https://datasheet.octopart.com/ESP32-WROOM-32E-N4-Espressif-Systems-datasheet-151884363.pdf?src-supplier=Future+Electronics; ComponentLink1Description: https://datasheet.octopart.com/ESP32-WROOM-32E-N4-Espressif-Systems-datasheet-151884363.pdf?src-supplier=Future+Electronics; ComponentLink2URL: https://datasheet.octopart.com/ESP32-WROOM-32E-N4-Espressif-Systems-datasheet-165560559.pdf?src-supplier=TME; ComponentLink2Description: https://datasheet.octopart.com/ESP32-WROOM-32E-N4-Espressif-Systems-datasheet-165560559.pdf?src-supplier=TME
U2 = CP2102N-A02-GQFN28: USB Bridge, USB to UART USB 2.0 UART Interface 28-QFN (5x5); Manufacturer: Silicon Labs; Supplier: Digikey; Supplier Part Number: 336-5889-ND; Manufacturer Part Number: CP2102N-A02-GQFN28; RoHS: Yes; Category: USB Interface ICs; Stock: 2154; Pricing: 1=5.79, 10=3.8, 73=2.81247, 146=2.57027, 292=2.36736, 511=2.22789, 1022=2.175 (USD); ComponentLink1URL: https://datasheet.ciiva.com:443/pdfs/VipMasterIC/IC/SILC/SILC-S-A0007770867/SILC-S-A0007770867-1.pdf?src-supplier=IHS+Markit; ComponentLink1Description: https://datasheet.ciiva.com:443/pdfs/VipMasterIC/IC/SILC/SILC-S-A0007770867/SILC-S-A0007770867-1.pdf?src-supplier=IHS+Markit
U3 = AMS1117-3.3: Linear Voltage Regulator IC Positive Fixed 1 Output 1A SOT-223-3L; Manufacturer: Revvo; Supplier: Digikey; Supplier Part Number: 5272-AMS1117-3.3CT-ND; Manufacturer Part Number: AMS1117-3.3; RoHS: No; Category: Voltage Regulators - Linear; Stock: 4413; Pricing: 1=0.63, 10=0.378, 25=0.3108, 100=0.2349, 250=0.19756, 500=0.17458, 1000=0.1553, 2500=0.13454, 5000=0.12177, 7500=0.11528, 12500=0.108, 17500=0.10371, 25000=0.09954, 62500=0.092 (USD)
U4 = TB6612FNG,C,8,EL: Brushless DC Motor Controller, 1A, BCDMOS, PDSO24; Manufacturer: Toshiba; Supplier: Digikey; Supplier Part Number: TB6612FNGC8ELCT-ND; Manufacturer Part Number: TB6612FNG,C,8,EL; RoHS: Yes; Category: Motor Drivers; Stock: 22646; Pricing: 1=2.89, 10=1.828, 25=1.5512, 100=1.2378, 250=1.08392, 500=0.98924, 1000=0.90997 (USD); ComponentLink1URL: https://datasheet.ciiva.com/12216/tb6612fng-datasheet-en-20141001-12216529.pdf?src-supplier=Mouser; ComponentLink1Description: https://datasheet.ciiva.com/12216/tb6612fng-datasheet-en-20141001-12216529.pdf?src-supplier=Mouser
U5 = ULN2003A: Bipolar (BJT) Transistor Array Through Hole 16-DIP; Manufacturer: STMicroelectronics; Package Body Material: Plastic; Transistor Element Material: SILICON; Surface Mount: No; Polarity/Channel Type: NPN; Max Collector Current: 500mA; Collector-emitter Voltage-Max: 50V; Number of Elements: 7; Transistor Application: SWITCHING; DC Current Gain-Min (hFE): 1000; VCEsat-Max: 1.6V; Qualification Status: Not Qualified; Supplier: Digikey; Supplier Part Number: 497-2344-5-ND; Manufacturer Part Number: ULN2003A; RoHS: Yes; Category: Integrated Circuits (ICs); Stock: 38293; Pricing: 1=0.43, 10=0.297, 25=0.2648, 100=0.2293, 250=0.21236, 500=0.20216, 1000=0.19375, 2500=0.18488, 5000=0.17954 (USD); Pins: 16; Package Shape: Rectangular; Terminal Finish: Tin; Max Operating Temperature: 150°C; JESD-30 Code: R-PDIP-T16; Package Style: IN-LINEMeter; Terminal Form: Through Hole; Terminal Position: DUAL; JESD-609 Code: e3; Reach SVHC Compliant: Yes; RoHS Compliant: Yes; ComponentLink1URL: https://datasheet.ciiva.com:443/pdfs/VipMasterIC/IC/SGST/SGST-S-A0008658005/SGST-S-A0008658005-1.pdf?src-supplier=IHS+Markit; ComponentLink1Description: https://datasheet.ciiva.com:443/pdfs/VipMasterIC/IC/SGST/SGST-S-A0008658005/SGST-S-A0008658005-1.pdf?src-supplier=IHS+Markit; ComponentLink2URL: https://datasheet.ciiva.com/15139/getdatasheetpartid-94437-15139993.pdf?src-supplier=Verical; ComponentLink2Description: https://datasheet.ciiva.com/15139/getdatasheetpartid-94437-15139993.pdf?src-supplier=Verical; ComponentLink3URL: https://datasheet.ciiva.com/29305/177970-da-01-en-uln2003-29305675.pdf?src-supplier=Conrad; ComponentLink3Description: https://datasheet.ciiva.com/29305/177970-da-01-en-uln2003-29305675.pdf?src-supplier=Conrad; ComponentLink4URL: https://datasheet.ciiva.com/1701/cd00001244-1701923.pdf?src-supplier=Digikey; ComponentLink4Description: https://datasheet.ciiva.com/1701/cd00001244-1701923.pdf?src-supplier=Digikey; ComponentLink5URL: https://datasheet.ciiva.com/4459/cd00001244-4459193.pdf?src-supplier=Mouser; ComponentLink5Description: https://datasheet.ciiva.com/4459/cd00001244-4459193.pdf?src-supplier=Mouser; ComponentLink6URL: https://datasheet.ciiva.com/14180/luuln2001-04-data-e-14180135.pdf?src-supplier=Distrelec; ComponentLink6Description: https://datasheet.ciiva.com/14180/luuln2001-04-data-e-14180135.pdf?src-supplier=Distrelec; ComponentLink7URL: https://datasheet.ciiva.com/6884/1690348-6884665.pdf?src-supplier=Newark; ComponentLink7Description: https://datasheet.ciiva.com/6884/1690348-6884665.pdf?src-supplier=Newark; ComponentLink8URL: https://datasheet.ciiva.com/1193/1690348-1193404.pdf?src-supplier=Element14; ComponentLink8Description: https://datasheet.ciiva.com/1193/1690348-1193404.pdf?src-supplier=Element14